# Altium schematic sheet 3.Heater_and_Temperature_sensor.SchDoc
size A4; SheetNumber: 4; SheetTotal: 13
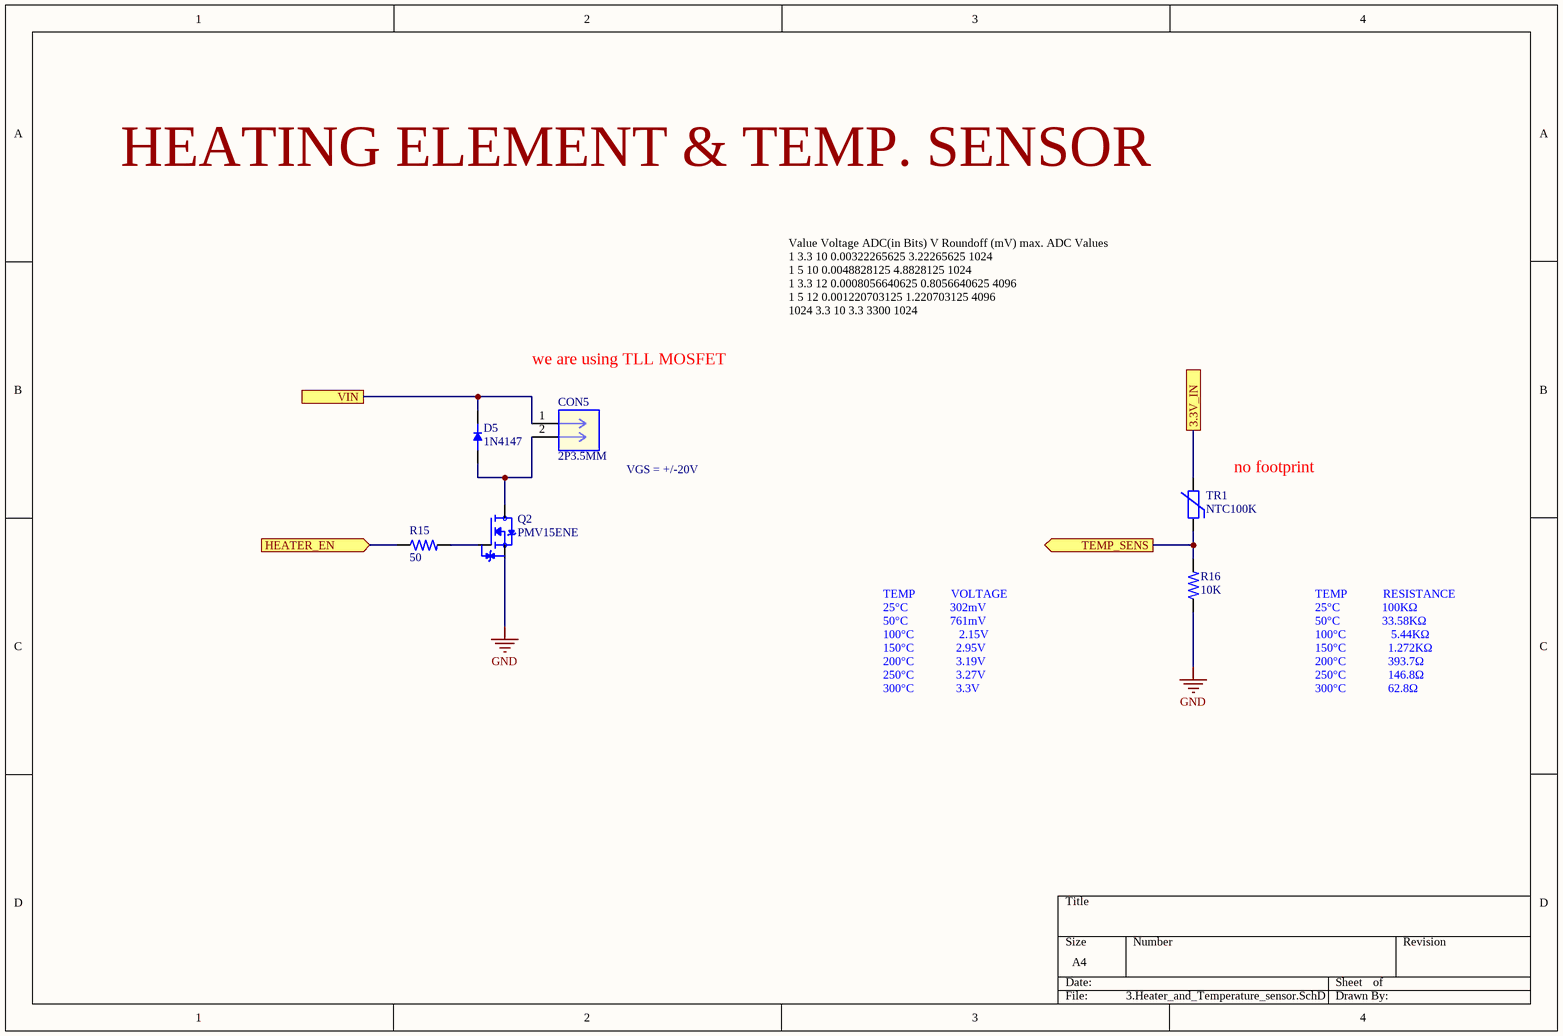
[diagram p0: 3.Heater_and_Temperature_sensor.SchDoc]

## Parts
CON5  2P3.5MM  [2P_P3.5mm]
D5  1N4147  [SOD123]
Q2  PMV15ENE  [SOT23FR]
R15  50  [R_0603]
R16  10K  [R_0603]
TR1  NTC100K

## Ports
3.3V_IN, HEATER_EN (in), TEMP_SENS (out), VIN

## Nets
GND: Q2.3(S) R16.1
3.3V_IN: TR1.1 ; port 3.3V_IN
HEATER_EN: R15.1 ; port HEATER_EN
TEMP_SENS: R16.2 TR1.2 ; port TEMP_SENS
VIN: CON5.1 D5.C(K) ; port VIN
NetCON5_2: CON5.2 D5.A Q2.1(D)
NetQ2_2: Q2.2(G) R15.2

## Notes on the sheet
- HEATING ELEMENT & TEMP. SENSOR
- we are using TLL MOSFET
- Value	Voltage	ADC(in Bits)	V	Roundoff (mV)	max. ADC Values
  1	3.3	10	0.00322265625	3.22265625	1024
  1	5	10	0.0048828125	4.8828125	1024
  1	3.3	12	0.0008056640625	0.8056640625	4096
  1	5	12	0.001220703125	1.220703125	4096
  1024	3.3	10	3.3	3300	1024
- VGS = +/-20V
- (near TR1) no footprint
- TEMP	           VOLTAGE
  25°C	             302mV
  50°C	             761mV
  100°C 	             2.15V
  150°C	             2.95V
  200°C	             3.19V
  250°C	             3.27V
  300°C	             3.3V
- TEMP	           RESISTANCE
  25°C	             100KΩ
  50°C	             33.58KΩ
  100°C 	             5.44KΩ
  150°C	             1.272KΩ
  200°C	             393.7Ω
  250°C	             146.8Ω
  300°C	             62.8Ω

## Library data of the parts
CON5 = 2P3.5MM: MFR: Molex; D: Headers & Wire Housings 2CKT 3.5MM W TO B C KT 3.5MM W TO B CONN; PN: 53258-0229; URL: https://www.mouser.in/ProductDetail/Molex/53258-0229?qs=yYVs2tXBqMMxmAbgTccg5w%3D%3D
D5 = 1N4147: MFR: Panjit; PN: 1N4148W_R2_00001; D: Diodes - General Purpose, Power, Switching SURFACE MOUNT SWITCHING DIODES; P: SOD123; URL: https://www.mouser.in/ProductDetail/Panjit/1N4148W_R2_00001?qs=sPbYRqrBIVlsNrvmMQOkFA%3D%3D
Q2 = PMV15ENE: MFR: Nexperia; P: SOT-23-3; PN: PMV15ENER; D: MOSFET PMV15ENE/SOT23/TO-236AB; URL: https://www.mouser.in/ProductDetail/Nexperia/PMV15ENER?qs=Li%252BoUPsLEntpTHKsialBmQ%3D%3D
R15 R16 = R_0603: D: *; MFR: *; P: *; PN: *; URL: *
TR1 = NTC100K: MFR: Bussmann / Eaton; PN: NRBG105J4200B1J; D: NTC (Negative Temperature Coefficient) Thermistors Single ended, Glass NTC, 100K ohm, 4200 B; P: 2.54mm; URL: https://www.mouser.in/ProductDetail/Bussmann-Eaton/NRBG105J4200B1J?qs=doiCPypUmgEX7C7T9ljJrw%3D%3D